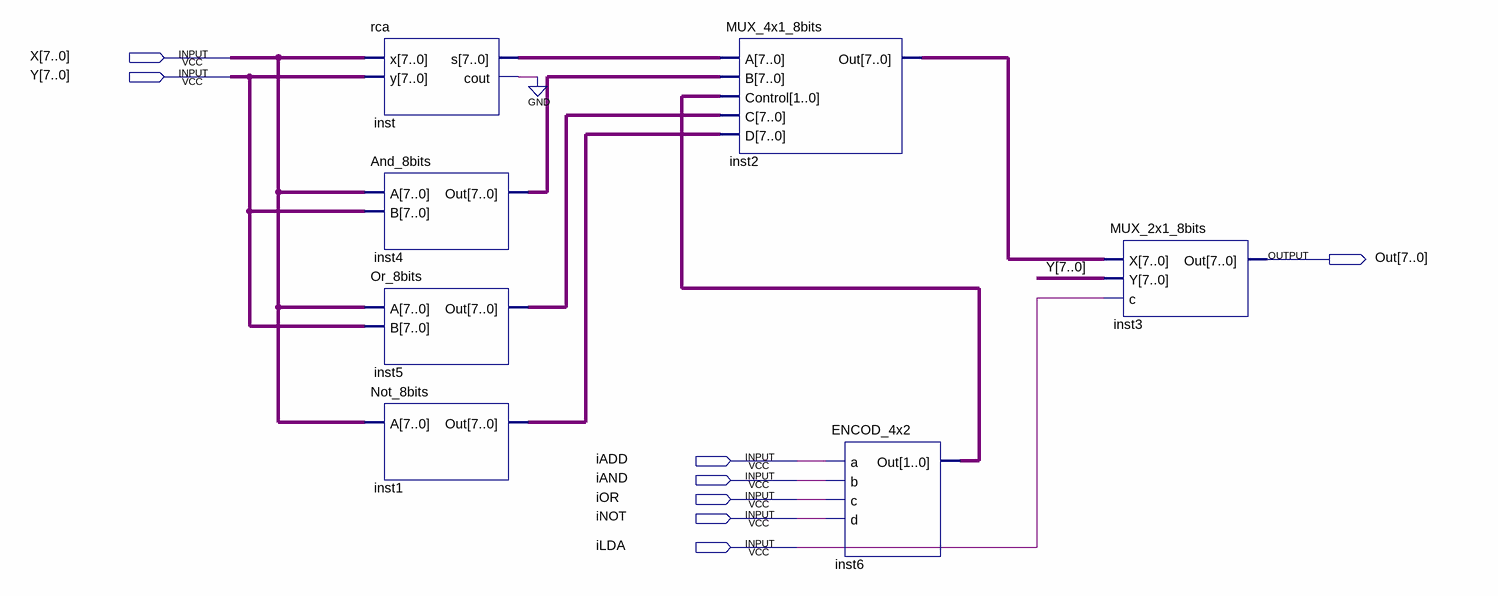
[diagram p0: schematic sheet]
// Quartus schematic ALU.bdf as structural Verilog: 7 symbols, 8 pins
module ALU (
  input  [7:0] X,
  input  [7:0] Y,
  input  iADD,
  input  iAND,
  input  iOR,
  input  iNOT,
  input  iLDA,
  output [7:0] Out
);

  wire inst_cout;
  wire [1:0] inst6_out;
  wire [7:0] inst1_out, inst2_out, inst4_out, inst5_out, inst_s;

  rca inst (.x(X), .y(Y), .s(inst_s), .cout(inst_cout));
  And_8bits inst4 (.A(X), .B(Y), .Out(inst4_out));
  Or_8bits inst5 (.A(X), .B(Y), .Out(inst5_out));
  Not_8bits inst1 (.A(X), .Out(inst1_out));
  MUX_4x1_8bits inst2 (.A(inst_s), .B(inst4_out), .Control(inst6_out), .C(inst5_out), .D(inst1_out), .Out(inst2_out));
  ENCOD_4x2 inst6 (.a(iADD), .b(iAND), .c(iOR), .d(iNOT), .Out(inst6_out));
  MUX_2x1_8bits inst3 (.X(inst2_out), .Y(Y), .c(iLDA), .Out(Out));
  // also tied to GND on the sheet: inst_cout
endmodule
